# EAGLE design leptanie_tl.hore (EAGLE 9.5.2)
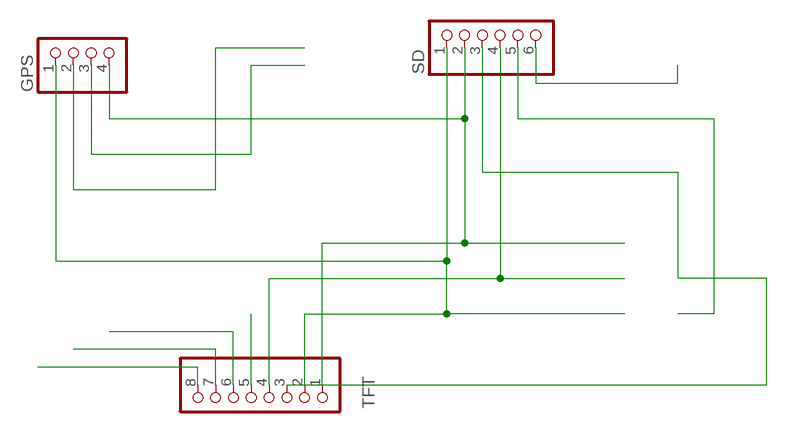
[diagram p0: schematic, sheet 1]

## Parts
GPS  PINHD-1X4  [1X04]
SD  PINHD-1X6  [1X06]
TFT  PINHD-1X8  [1X08]

## Nets
MOSI: SD.4 TFT.4
N$1: SD.6
N$2: SD.5
N$3: TFT.5
N$4: SD.3 TFT.3
N$5: GPS.4 SD.2 TFT.1
N$6: TFT.6
N$7: GPS.2
N$8: GPS.3
N$9: TFT.7
N$10: TFT.8
S: GPS.1 SD.1 TFT.2

## Library data of the parts
GPS = pinhead:PINHD-1X4: PIN HEADER
SD = pinhead:PINHD-1X6: PIN HEADER
TFT = pinhead:PINHD-1X8: PIN HEADER

## Board
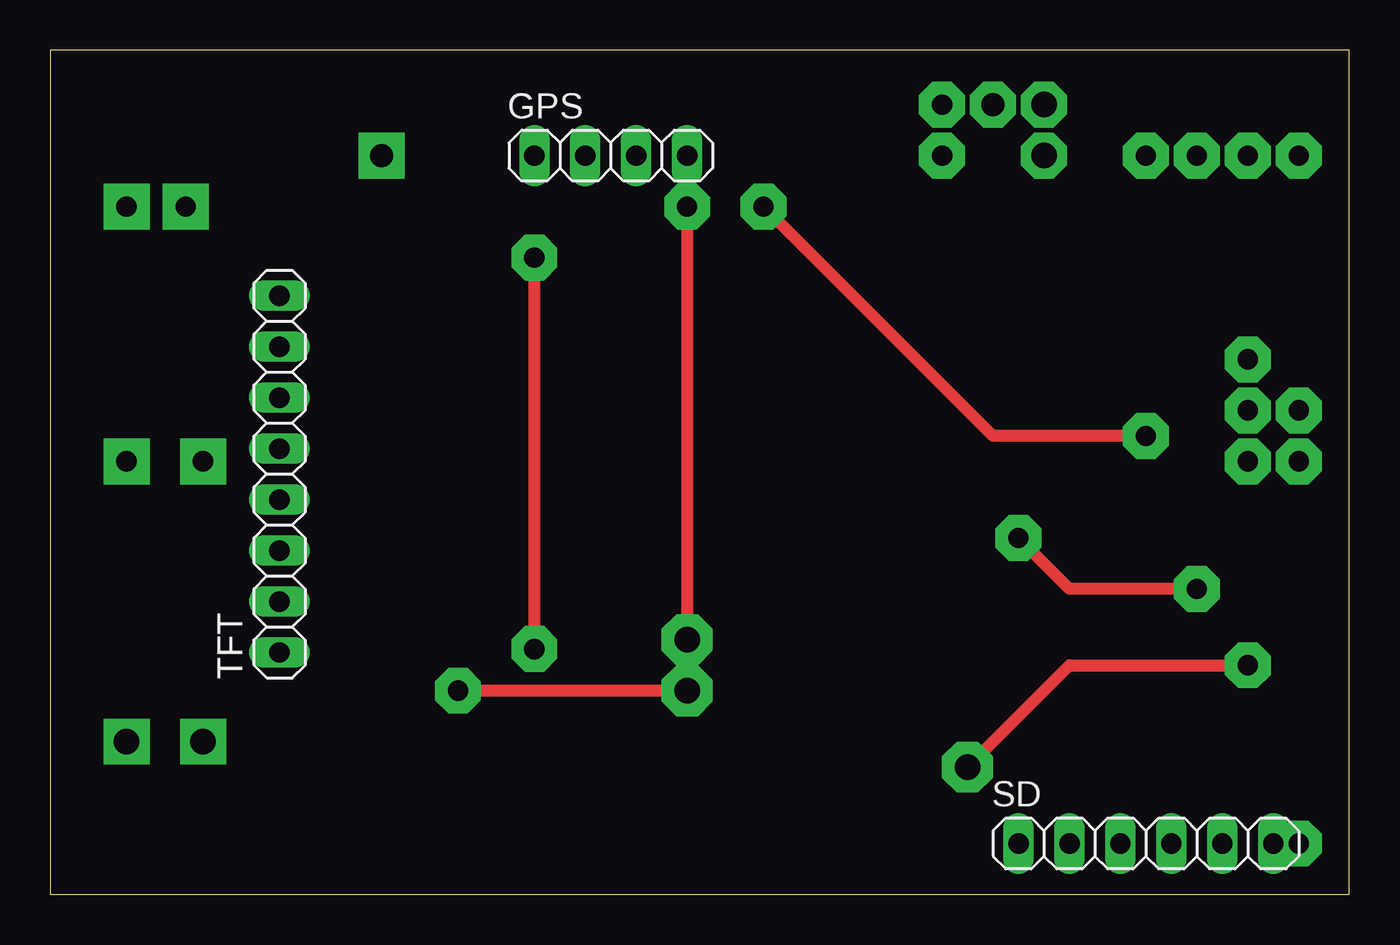
[diagram p1: board, top side]
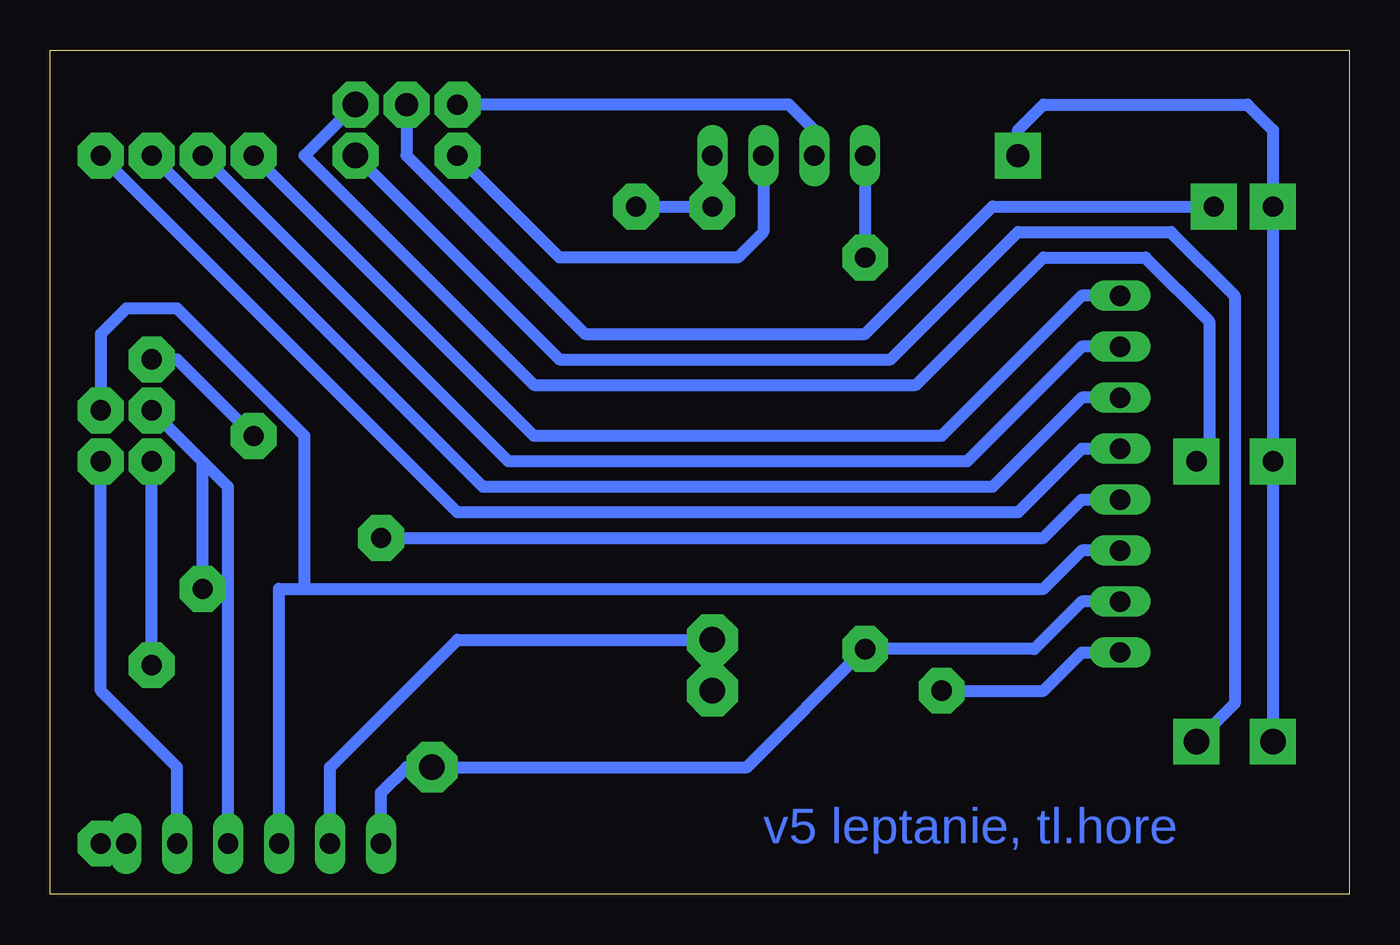
[diagram p2: board, bottom side, seen from below]

Size 64.75 x 42.09 mm. Coordinates in mm from the lower left corner, seen from the top.
Outline: 0,0 64.75,0 64.75,42.09 0,42.09 0,0
Copper layers (1*16): Top 0.035mm / dielectric 1.5mm / Bottom 0.035mm
Design rules "default": minimum track width 6mil, minimum drill 0.35mm, track to track 6mil, track to pad 6mil, pad to pad 6mil, via to via 6mil, smd to smd 6mil, copper to edge 40mil, drill to drill 6mil, minimum pad ring 10mil, minimum via ring 8mil, stop-mask expansion 4mil, vias tented up to drill 0mil, thermal gap 10mil

### Footprints (pad centres in the part's own frame; a part is rotated, then mirrored left to right if it is on the bottom)
1X04 = drill 1.016 long: 1 -3.81,0; 2 -1.27,0; 3 1.27,0; 4 3.81,0
1X06 = drill 1.016 long: 1 -6.35,0; 2 -3.81,0; 3 -1.27,0; 4 1.27,0; 5 3.81,0; 6 6.35,0
1X08 = drill 1.016 long: 1 -8.89,0; 2 -6.35,0; 3 -3.81,0; 4 -1.27,0; 5 1.27,0; 6 3.81,0; 7 6.35,0; 8 8.89,0

### Placement (x,y rotation side)
GPS  27.94,36.83 0 top
SD  54.61,2.54 0 top
TFT  11.43,20.95 90 top

### Tracks (layer width: path | path; a pad name or v marks a point on that pad's centre or on a via)
MOSI  (via drill 1 pad 2.29, 1.02 pad 2.29)
  Top 0.61: v48.26,17.78 50.8,15.24 v57.15,15.24
  Bottom 0.61: SD.4 55.88,20.32 57.15,21.59 | v48.26,17.78 15.24,17.78 13.34,19.69 TFT.4 | v57.15,15.24 57.15,21.59 | 57.15,21.59 v59.69,24.13
N$1  (via drill 1.02 pad 2.29)
  Bottom 0.61: SD.6 v62.23,2.54
N$2  (via drill 1.02 pad 2.29)
  Bottom 0.61: SD.5 58.42,6.35 62.23,10.16 v62.23,21.59
N$3  (via drill 1.02 pad 2.29)
  Bottom 0.61: TFT.5 13.34,22.23 16.51,19.05 44.45,19.05 v62.23,36.83
N$4  (via drill 1.02 pad 2.29)
  Bottom 0.61: SD.3 53.34,15.24 52.07,15.24 | 52.07,15.24 52.07,22.86 58.42,29.21 60.96,29.21 62.23,27.94 v62.23,24.13 | 52.07,15.24 15.24,15.24 13.34,17.15 TFT.3
N$5  (via drill 1 pad 2.29, 1.02 pad 2.29, 1.27 pad 2.54)
  Top 0.61: v31.75,10.16 v20.32,10.16 | v31.75,34.29 v31.75,12.7 | v54.61,22.86 46.99,22.86 v35.56,34.29
  Bottom 0.61: v54.61,22.86 58.42,26.67 v59.69,26.67 | GPS.4 v31.75,34.29 v35.56,34.29 | SD.2 50.8,6.35 44.45,12.7 v31.75,12.7 v31.75,10.16 | v20.32,10.16 15.24,10.16 13.34,12.07 TFT.1
N$6  (via drill 1.02 pad 2.29)
  Bottom 0.61: TFT.6 13.34,24.77 17.78,20.32 43.18,20.32 v59.69,36.83
N$7  (via drill 1.02 pad 2.29)
  Bottom 0.61: GPS.2 26.67,38.1 27.94,39.37 v44.45,39.37
N$8  (via drill 1.02 pad 2.29)
  Bottom 0.61: GPS.3 29.21,33.02 30.48,31.75 39.37,31.75 v44.45,36.83
N$9  (via drill 1.02 pad 2.29)
  Bottom 0.61: TFT.7 13.34,27.31 19.05,21.59 41.91,21.59 v57.15,36.83
N$10  (via drill 1.02 pad 2.29)
  Bottom 0.61: TFT.8 13.34,29.84 20.32,22.86 40.64,22.86 v54.61,36.83
N$12  (via drill 1.02 pad 2.29, 1.14 pad 2.29, 1.27 pad 2.29)
  Bottom 0.61: v16.51,36.83 16.51,38.1 15.24,39.37 5.08,39.37 3.81,38.1 v3.81,34.29 v3.81,21.59 v3.81,7.62
N$13  (via drill 1.27 pad 2.29)
  Bottom 0.61: v49.53,36.83 39.37,26.67 22.86,26.67 16.51,33.02 8.89,33.02 5.71,29.84 5.71,9.52 v7.62,7.62
N$14  (via drill 1.02 pad 2.29, 1.27 pad 2.29)
  Bottom 0.61: v49.53,39.37 52.07,36.83 40.64,25.4 21.59,25.4 15.24,31.75 10.16,31.75 6.98,28.58 6.98,22.23 v7.62,21.59
N$15  (via drill 1.02 pad 2.29, 1.14 pad 2.29)
  Bottom 0.61: v46.99,39.37 46.99,36.83 38.1,27.94 24.13,27.94 17.78,34.29 v6.76,34.29
S  (via drill 1 pad 2.29, 1.02 pad 2.29, 1.27 pad 2.54)
  Top 0.61: v45.72,6.35 50.8,11.43 v59.69,11.43 | v24.13,12.23 v24.13,31.75
  Bottom 0.61: GPS.1 v24.13,31.75 | SD.1 48.26,5.08 46.99,6.35 v45.72,6.35 30.01,6.35 v24.13,12.23 15.71,12.23 13.34,14.61 TFT.2 | v59.69,11.43 v59.69,21.59

### Text on the board
Bottom: v5 leptanie, tl.hore